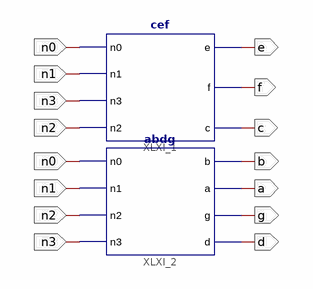
[diagram p0: schematic sheet 1]
// Xilinx ISE schematic seven_seg2.sch (spartan3e) as structural Verilog: 2 symbols, 11 ports
module seven_seg2 (
  input  n0,
  input  n1,
  input  n3,
  input  n2,
  output d,
  output g,
  output a,
  output b,
  output c,
  output f,
  output e
);

  cef XLXI_1 (.n0(n0), .n1(n1), .n3(n3), .n2(n2), .e(e), .f(f), .c(c));
  abdg XLXI_2 (.n0(n0), .n1(n1), .n2(n2), .n3(n3), .b(b), .a(a), .g(g), .d(d));
endmodule
